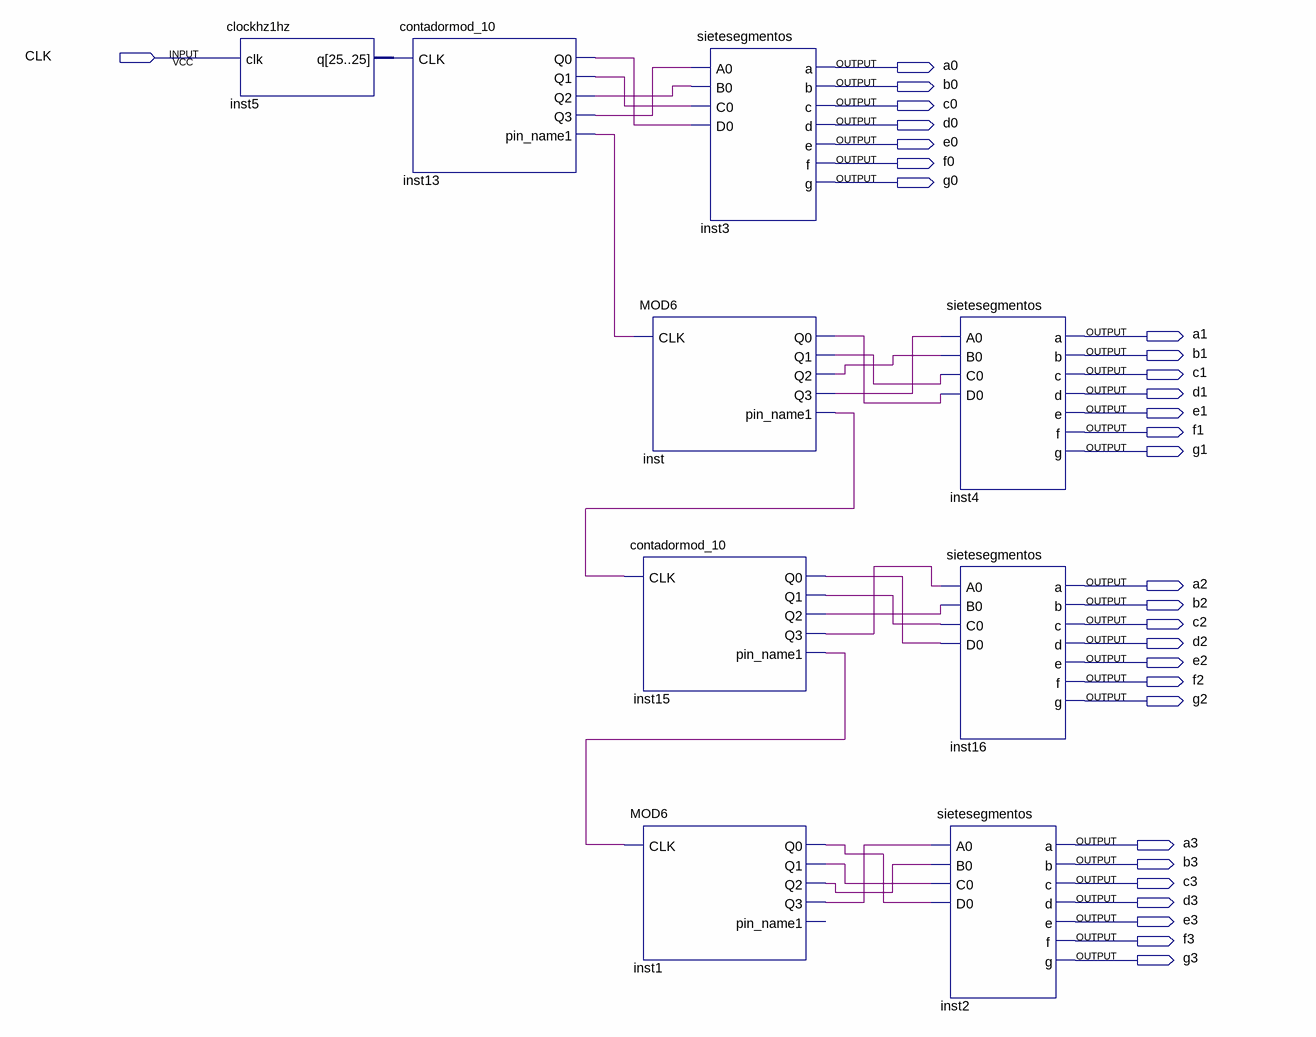
[diagram p0: schematic sheet]
// Quartus schematic clk.bdf as structural Verilog: 9 symbols, 29 pins
module clk (
  input  CLK,
  output a0,
  output b0,
  output c0,
  output d0,
  output e0,
  output f0,
  output g0,
  output a1,
  output b1,
  output c1,
  output d1,
  output e1,
  output f1,
  output g1,
  output a2,
  output b2,
  output c2,
  output d2,
  output e2,
  output f2,
  output g2,
  output a3,
  output b3,
  output c3,
  output d3,
  output e3,
  output f3,
  output g3
);

  wire inst1_q0, inst1_q1, inst1_q2, inst1_q3, inst5_q, inst13_pin_name1, inst13_q0, inst13_q1, inst13_q2,
       inst13_q3, inst15_pin_name1, inst15_q0, inst15_q1, inst15_q2, inst15_q3, inst_pin_name1, inst_q0,
       inst_q1, inst_q2, inst_q3;

  clockhz1hz inst5 (.clk(CLK), .q(inst5_q));
  contadormod_10 inst13 (
    .CLK(inst5_q), .Q0(inst13_q0), .Q1(inst13_q1), .Q2(inst13_q2), .Q3(inst13_q3),
    .pin_name1(inst13_pin_name1));
  MOD6 inst (
    .CLK(inst13_pin_name1), .Q0(inst_q0), .Q1(inst_q1), .Q2(inst_q2), .Q3(inst_q3), .pin_name1(inst_pin_name1));
  contadormod_10 inst15 (
    .CLK(inst_pin_name1), .Q0(inst15_q0), .Q1(inst15_q1), .Q2(inst15_q2), .Q3(inst15_q3),
    .pin_name1(inst15_pin_name1));
  MOD6 inst1 (.CLK(inst15_pin_name1), .Q0(inst1_q0), .Q1(inst1_q1), .Q2(inst1_q2), .Q3(inst1_q3));  // open: pin_name1
  sietesegmentos inst3 (
    .A0(inst13_q3), .B0(inst13_q2), .C0(inst13_q1), .D0(inst13_q0), .a(a0), .b(b0), .c(c0), .d(d0), .e(e0),
    .f(f0), .g(g0));
  sietesegmentos inst4 (
    .A0(inst_q3), .B0(inst_q2), .C0(inst_q1), .D0(inst_q0), .a(a1), .b(b1), .c(c1), .d(d1), .e(e1), .f(f1),
    .g(g1));
  sietesegmentos inst16 (
    .A0(inst15_q3), .B0(inst15_q2), .C0(inst15_q1), .D0(inst15_q0), .a(a2), .b(b2), .c(c2), .d(d2), .e(e2),
    .f(f2), .g(g2));
  sietesegmentos inst2 (
    .A0(inst1_q3), .B0(inst1_q2), .C0(inst1_q1), .D0(inst1_q0), .a(a3), .b(b3), .c(c3), .d(d3), .e(e3),
    .f(f3), .g(g3));
endmodule
